# Altium schematic sheet STM32F407VG-E.SchDoc
size A4
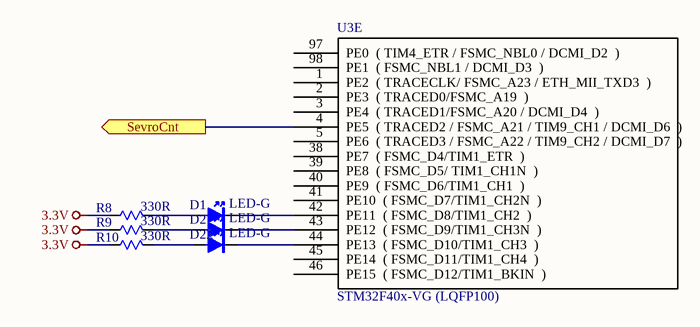
[diagram p0: STM32F407VG-E.SchDoc]

## Parts
D1  LED-G  [LED0603]
D2  LED-G  [LED0603]
D22  LED-G  [LED0603]
R8  330R  [R0603-S]
R9  330R  [R0603-S]
R10  330R  [R0603-S]
U3  STM32F40x-VG (LQFP100)  [LQFP100_N]  (part E of 6)

## Ports
SevroCnt (out)

## Nets
3.3V: R8.2 R9.2 R10.2
SevroCnt: U3.4(PE5__(_TRACED2_/_FSMC_A21_/_TIM9_CH1_/_DCMI_D6__)) ; port SevroCnt
NetD1_1: D1.1(A) R8.1
NetD1_2: D1.2(K) U3.42(PE11__(_FSMC_D8/TIM1_CH2__))
NetD2_1: D2.1(A) R9.1
NetD2_2: D2.2(K) U3.43(PE12__(_FSMC_D9/TIM1_CH3N__))
NetD22_1: D22.1(A) R10.1
NetD22_2: D22.2(K) U3.44(PE13__(_FSMC_D10/TIM1_CH3__))

Not connected (* = marked no-connect by the designer): U3 1(PE2__(_TRACECLK/_FSMC_A23_/_ETH_MII_TXD3__)) 2(PE3__(_TRACED0/FSMC_A19__)) 3(PE4__(_TRACED1/FSMC_A20_/_DCMI_D4__)) 5(PE6__(_TRACED3_/_FSMC_A22_/_TIM9_CH2_/_DCMI_D7__)) 38(PE7__(_FSMC_D4/TIM1_ETR__)) 39(PE8__(_FSMC_D5/_TIM1_CH1N__)) 40(PE9__(_FSMC_D6/TIM1_CH1__)) 41(PE10__(_FSMC_D7/TIM1_CH2N__)) 45(PE14__(_FSMC_D11/TIM1_CH4__)) 46(PE15__(_FSMC_D12/TIM1_BKIN__)) 97(PE0__(_TIM4_ETR_/_FSMC_NBL0_/_DCMI_D2__)) 98(PE1__(_FSMC_NBL1_/_DCMI_D3__))

## Library data of the parts
D1 D2 D22 = LED
R8-R10 = Res: Resistor; Published: 8-Jun-2000; LatestRevisionDate: 04-Mar-2005; LatestRevisionNote: PCB Footprint replaced.; PackageReference: J1-0603; Publisher: Altium Limited; Value: 330R
U3 = STM32F40x-VG